# Altium schematic sheet 数控.SchDoc
size A4
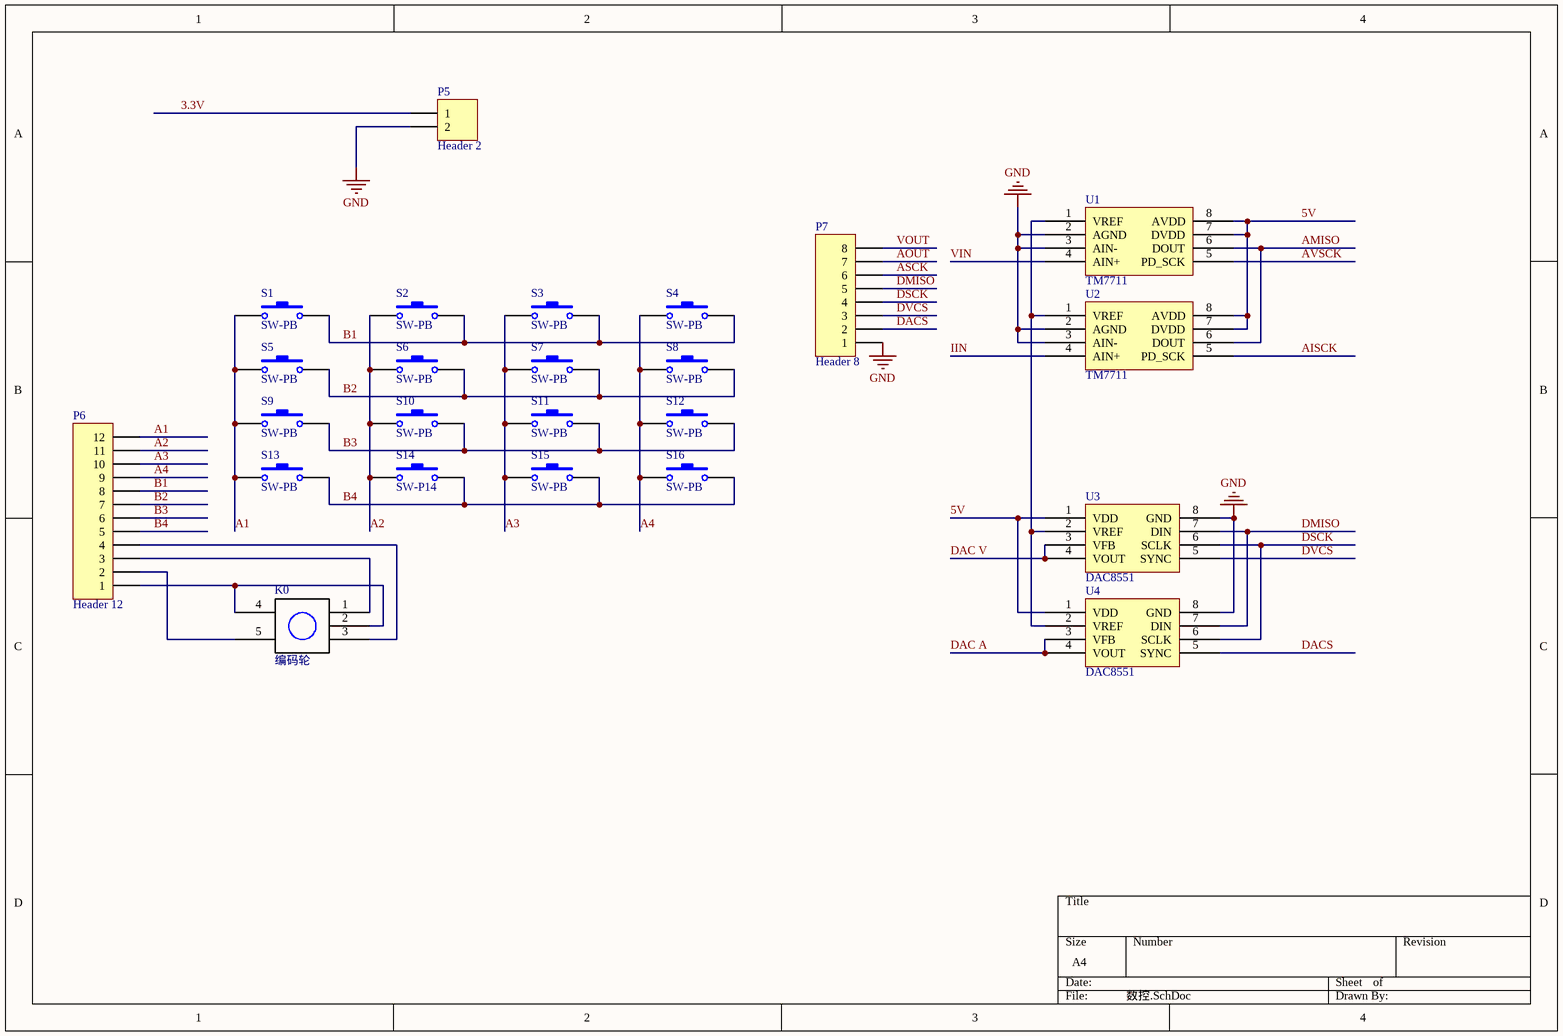
[diagram p0: 数控.SchDoc]

## Parts
K0  编码轮
P5  Header 2  [HDR1X2]
P6  Header 12  [HDR1X12]
P7  Header 8  [HDR1X8]
S1  SW-PB  [SPST-2]
S2  SW-PB  [SPST-2]
S3  SW-PB  [SPST-2]
S4  SW-PB  [SPST-2]
S5  SW-PB  [SPST-2]
S6  SW-PB  [SPST-2]
S7  SW-PB  [SPST-2]
S8  SW-PB  [SPST-2]
S9  SW-PB  [SPST-2]
S10  SW-PB  [SPST-2]
S11  SW-PB  [SPST-2]
S12  SW-PB  [SPST-2]
S13  SW-PB  [SPST-2]
S14  SW-P14  [SPST-2]
S15  SW-PB  [SPST-2]
S16  SW-PB  [SPST-2]
U1  TM7711
U2  TM7711
U3  DAC8551
U4  DAC8551

## Nets
GND: P5.2 P7.1 U1.2(AGND) U1.3(AIN-) U2.2(AGND) U2.3(AIN-) U3.8(GND) U4.8(GND)
3.3V: P5.1
5V: U1.7(DVDD) U1.8(AVDD) U2.7(DVDD) U2.8(AVDD) U3.1(VDD) U4.1(VDD)
A1: P6.12 S1.1 S5.1 S9.1 S13.1
A2: P6.11 S2.1 S6.1 S10.1 S14.1
A3: P6.10 S3.1 S7.1 S11.1 S15.1
A4: P6.9 S4.1 S8.1 S12.1 S16.1
AISCK: U2.5(PD_SCK)
AMISO: U1.6(DOUT) U2.6(DOUT)
AOUT: P7.7
ASCK: P7.6
AVSCK: U1.5(PD_SCK)
B1: P6.8 S1.2 S2.2 S3.2 S4.2
B2: P6.7 S5.2 S6.2 S7.2 S8.2
B3: P6.6 S9.2 S10.2 S11.2 S12.2
B4: P6.5 S13.2 S14.2 S15.2 S16.2
DAC A: U4.3(VFB) U4.4(VOUT)
DAC V: U3.3(VFB) U3.4(VOUT)
DACS: P7.2 U4.5(SYNC)
DMISO: P7.5 U3.7(DIN) U4.7(DIN)
DSCK: P7.4 U3.6(SCLK) U4.6(SCLK)
DVCS: P7.3 U3.5(SYNC)
IIN: U2.4(AIN+)
VIN: U1.4(AIN+)
VOUT: P7.8
NetK0_1: K0.1 P6.3
NetK0_2: K0.2 K0.4 P6.1
NetK0_3: K0.3 P6.4
NetK0_5: K0.5 P6.2
NetU1_1: U1.1(VREF) U2.1(VREF) U3.2(VREF) U4.2(VREF)

## Library data of the parts
P5 = Header 2: Header, 2-Pin; LatestRevisionDate: 17-Jul-2002; LatestRevisionNote: Re-released for DXP Platform.; Publisher: Altium Limited
P6 = Header 12: Header, 12-Pin; LatestRevisionDate: 17-Jul-2002; LatestRevisionNote: Re-released for DXP Platform.; Publisher: Altium Limited
P7 = Header 8: Header, 8-Pin; LatestRevisionDate: 17-Jul-2002; LatestRevisionNote: Re-released for DXP Platform.; Publisher: Altium Limited
S1-S16 = SW-PB: Switch; Published: 24-Mar-1999; LatestRevisionDate: 17-Jul-2002; LatestRevisionNote: Re-released for DXP Platform.; PackageReference: SPST-2; Publisher: Altium Limited; PackageDescription: Switch; 2 Leads